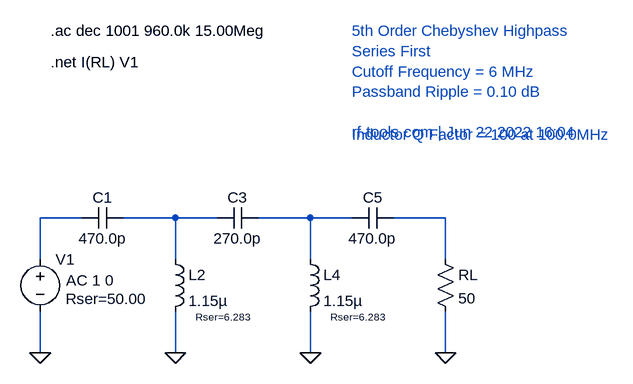
[diagram p0: schematic 6M.asc]
6M.asc, the LTspice schematic file:
Version 4
SHEET 1 1200 400
WIRE 64 0 0 0
WIRE 208 0 128 0
WIRE 272 0 208 0
WIRE 416 0 336 0
WIRE 480 0 416 0
WIRE 624 0 544 0
WIRE 0 64 0 0
WIRE 208 64 208 0
WIRE 416 64 416 0
WIRE 624 64 624 0
WIRE 0 208 0 144
WIRE 208 208 208 144
WIRE 416 208 416 144
WIRE 624 208 624 144
FLAG 0 208 0
FLAG 208 208 0
FLAG 416 208 0
FLAG 624 208 0
SYMBOL voltage 0 48 R0
WINDOW 123 40 48 Left 2
WINDOW 39 39 77 Left 2
SYMATTR Value2 AC 1 0
SYMATTR SpiceLine Rser=50.00
SYMATTR InstName V1
SYMATTR Value ""
SYMBOL cap 64 16 R270
WINDOW 0 32 32 VTop 2
WINDOW 3 0 32 VBottom 2
SYMATTR InstName C1
SYMATTR Value 470.0p
SYMBOL ind 192 48 R0
WINDOW 39 89 94 Top 1
SYMATTR InstName L2
SYMATTR Value 1.15µ
SYMATTR SpiceLine Rser=6.283
SYMBOL cap 272 16 R270
WINDOW 0 32 32 VTop 2
WINDOW 3 0 32 VBottom 2
SYMATTR InstName C3
SYMATTR Value 270.0p
SYMBOL ind 400 48 R0
WINDOW 39 89 94 Top 1
SYMATTR InstName L4
SYMATTR Value 1.15µ
SYMATTR SpiceLine Rser=6.283
SYMBOL cap 480 16 R270
WINDOW 0 32 32 VTop 2
WINDOW 3 0 32 VBottom 2
SYMATTR InstName C5
SYMATTR Value 470.0p
SYMBOL res 608 48 R0
SYMATTR InstName RL
SYMATTR Value 50
TEXT 16 -288 Left 2 !.ac dec 1001 960.0k 15.00Meg
TEXT 16 -240 Left 2 !.net I(RL) V1
TEXT 480 -288 Left 2 ;5th Order Chebyshev Highpass\nSeries First\nCutoff Frequency = 6 MHz\nPassband Ripple = 0.10 dB\n\nrf-tools.com | Jun 22 2022 16:04
TEXT 480 -128 Left 2 ;Inductor Q Factor = 100 at 100.0MHz

The netlist it stands for:
* 6M.asc
V1 N001 0 AC 1 0 Rser=50.00
C1 N001 N002 470.0p
L2 N002 0 1.15µ Rser=6.283
C3 N002 N003 270.0p
L4 N003 0 1.15µ Rser=6.283
C5 N003 N004 470.0p
RL N004 0 50
.ac dec 1001 960.0k 15.00Meg
.net I(RL) V1
* 5th Order Chebyshev Highpass
* Series First
* Cutoff Frequency = 6 MHz
* Passband Ripple = 0.10 dB
* rf-tools.com | Jun 22 2022 16:04
* Inductor Q Factor = 100 at 100.0MHz
.backanno
.end